# Altium schematic sheet LCDTFT_FPC40P_DBI16B_3.2INCH_RTP.SchDoc
size A3; SheetNumber: 6; SheetTotal: 7
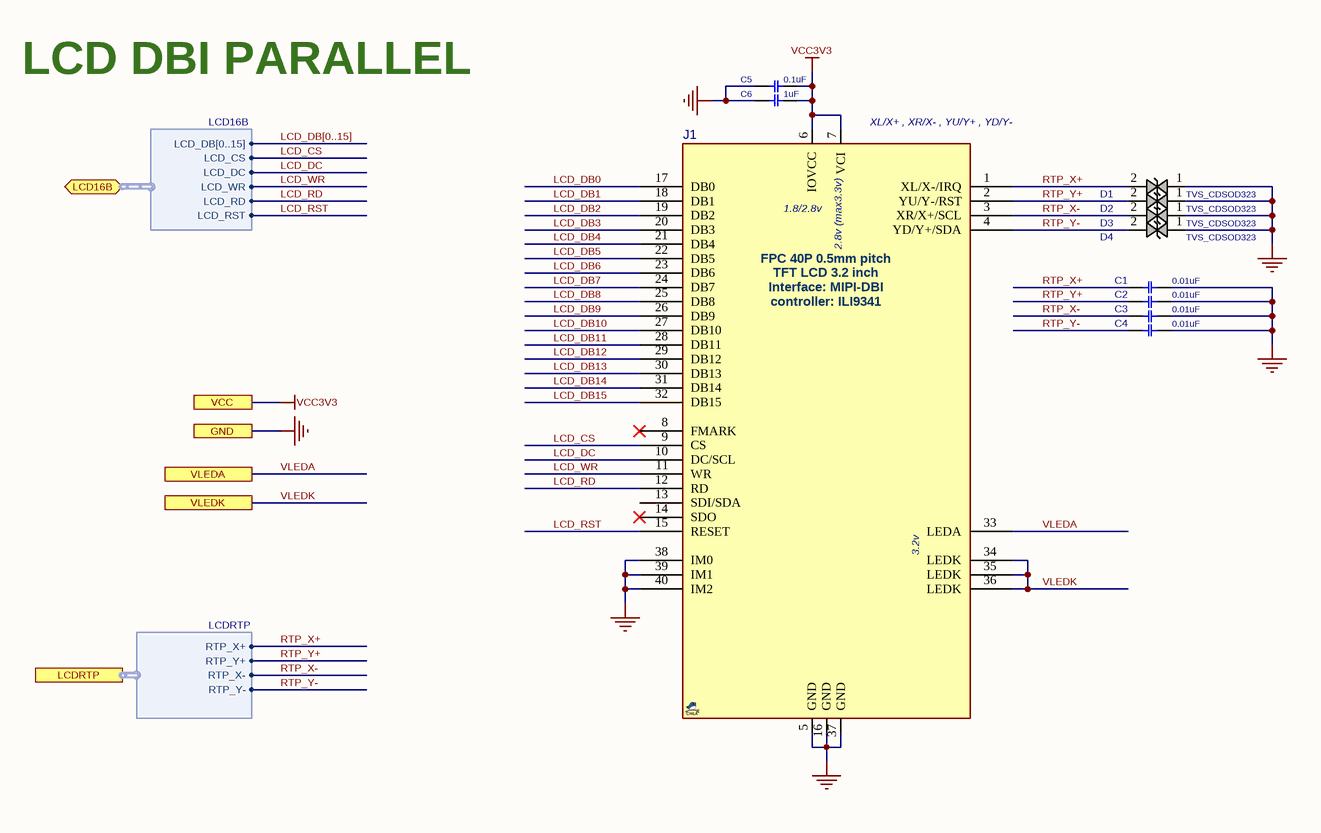
[diagram p0: LCDTFT_FPC40P_DBI16B_3.2INCH_RTP.SchDoc]

## Parts
C1  0.01uF  [C0402]
C2  0.01uF  [C0402]
C3  0.01uF  [C0402]
C4  0.01uF  [C0402]
C5  0.1uF  [C0402]
C6  1uF  [C0402]
D1  TVS_CDSOD323  [D0805]
D2  TVS_CDSOD323  [D0805]
D3  TVS_CDSOD323  [D0805]
D4  TVS_CDSOD323  [D0805]
J1  FPC50_40  [FPC50_40T]  (value not drawn)

## Ports
GND, LCD16B (bidir, harness LCD16B), LCDRTP (harness LCDRTP), VCC, VLEDA, VLEDK

## Harnesses
LCDRTP: RTP_X+, RTP_Y+, RTP_X-, RTP_Y-
LCD16B: LCD_DB[0..15], LCD_CS, LCD_DC, LCD_WR, LCD_RD, LCD_RST

## Nets
GND: C1.1 C2.1 C3.1 C4.1 C5.2 C6.2 D1.1 D2.1 D3.1 D4.1 J1.5(GND) J1.16(GND) J1.37(GND) J1.38(IM0) J1.39(IM1) J1.40(IM2) ; port GND
VCC3V3: C5.1 C6.1 J1.6(IOVCC) J1.7(VCI) ; port VCC
LCD_CS: J1.9(CS) ; port LCD16B.LCD_CS
LCD_DB0: J1.17(DB0)
LCD_DB1: J1.18(DB1)
LCD_DB2: J1.19(DB2)
LCD_DB3: J1.20(DB3)
LCD_DB4: J1.21(DB4)
LCD_DB5: J1.22(DB5)
LCD_DB6: J1.23(DB6)
LCD_DB7: J1.24(DB7)
LCD_DB8: J1.25(DB8)
LCD_DB9: J1.26(DB9)
LCD_DB10: J1.27(DB10)
LCD_DB11: J1.28(DB11)
LCD_DB12: J1.29(DB12)
LCD_DB13: J1.30(DB13)
LCD_DB14: J1.31(DB14)
LCD_DB15: J1.32(DB15)
LCD_DC: J1.10(DC/SCL) ; port LCD16B.LCD_DC
LCD_RD: J1.12(RD) ; port LCD16B.LCD_RD
LCD_RST: J1.15(RESET) ; port LCD16B.LCD_RST
LCD_WR: J1.11(WR) ; port LCD16B.LCD_WR
RTP_X+: C1.2 D1.2 J1.1(XL/X-/IRQ) ; port LCDRTP.RTP_X+
RTP_X-: C3.2 D3.2 J1.3(XR/X+/SCL) ; port LCDRTP.RTP_X-
RTP_Y+: C2.2 D2.2 J1.2(YU/Y-/RST) ; port LCDRTP.RTP_Y+
RTP_Y-: C4.2 D4.2 J1.4(YD/Y+/SDA) ; port LCDRTP.RTP_Y-
VLEDA: J1.33(LEDA) ; port VLEDA
VLEDK: J1.34(LEDK) J1.35(LEDK) J1.36(LEDK) ; port VLEDK

Not connected (* = marked no-connect by the designer): J1 8(FMARK)* 13(SDI/SDA) 14(SDO)*

## Buses and harness runs
bus LCD_DB[0..15]

## Notes on the sheet
- LCD DBI PARALLEL
- (near J1) XL/X+ , XR/X- , YU/Y+ , YD/Y-
- (in symbol LCDTFT_DBI_FPC40P_3.2INCH) 1.8/2.8v; 2.8v (max3.3v); FPC 40P 0.5mm pitch; TFT LCD 3.2 inch; Interface: MIPI-DBI; controller: ILI9341; 3.2v

## Library data of the parts
C1-C4 = CAP_SMD_MLCC: CAP, MLCC; PARAM: X5R, 10%; PARAM2: 50v; PRICE: 50,000:	$0.006; MANF_P#: -; MANF: -; ASSEMBLY: ASSEMBLY; VALUE: 0.01uF
C5 = CAP_SMD_MLCC: CAP, MLCC; PARAM: X7R, 10%, -55~125oC; MANF_P#: GRM155R71H104KE14D; MANF: Murata; PARAM2: 50v; PRICE: 100: 0.018$; ASSEMBLY: ASSEMBLY; VALUE: 0.1uF
C6 = CAP_SMD_MLCC: CAP, MLCC; PARAM: X5R, 10%; PRICE: 50,000:	$0.006; MANF_P#: -; MANF: -; PARAM2: -; ASSEMBLY: ASSEMBLY; VALUE: 1uF
D1-D4 = TVS_CDSOD323: TVS, ESD PROTECT, Bidirectional; MANF_P#: CDSOD323-T12C; MANF: Bourns; PARAM2: 13.3VB, 12VR; PRICE: 0.7$; VALUE: TVS_CDSOD323
J1 = LCDTFT_DBI_FPC40P_3.2INCH: LCD TFT Color, FPC40P, 3.2" with touch; MANF: Hirose; MANF_P#: FH12A-40S-0.5SH; VALUE: FPC50_40